# Altium schematic sheet Encoder.SchDoc: Acondicionamiento Encoder
size A4; Author: Anderson, Jorge.; CompanyName: LEICI - FI-UNLP; DocumentNumber: 1; Revision: 1.1; SheetNumber: 3; SheetTotal: 5; PageSetup: Record=PageOptions|CenterHorizontal=True|CenterVertical=True|PrintScale=1.00|XCorrection=1.00|YCorrection=1.00|PrintKind=0|BorderSize=5000000|LeftOffset=0|BottomOffset=0|Orientation=2|PaperLength=1000|PaperWidth=1000|Scale=100|PaperSource=7|PrintQuality=-3|MediaType=1|DitherType=10|PrintScaleMode=1|PaperKind=A4|PaperIndex=9; ProjectName: Placa Adaptadora TMS320F28335
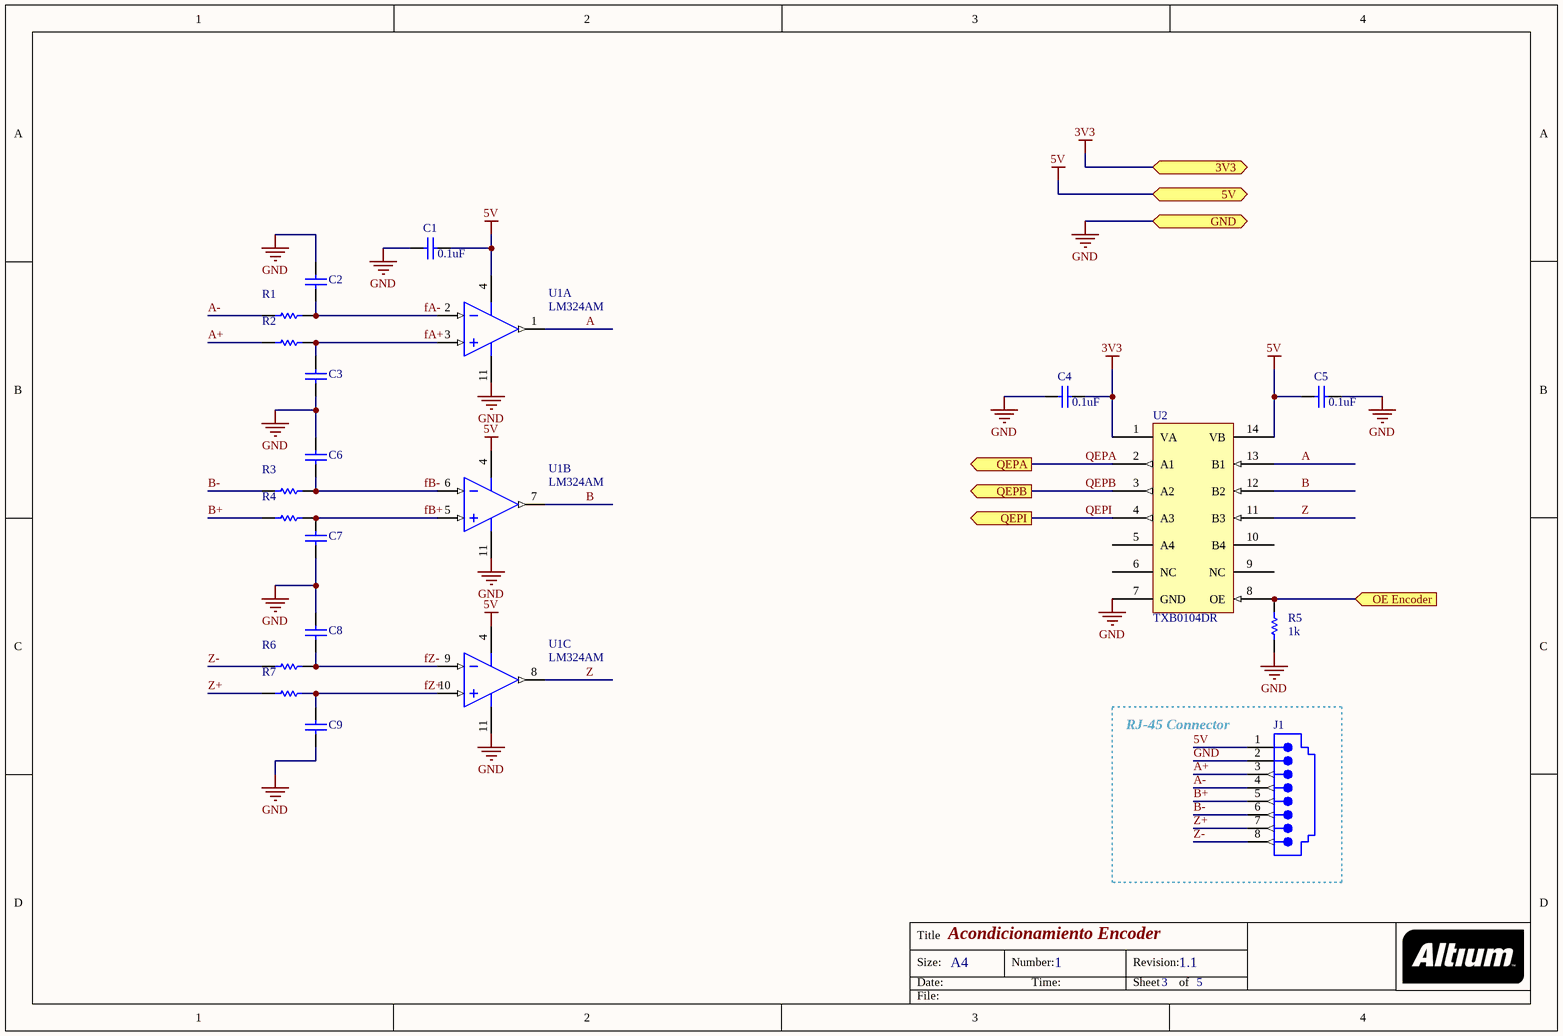
[diagram p0: Encoder.SchDoc]

## Parts
C1  value 0.1uF  [C 1206]  (hidden comment: C0.1u)
C2  C?  [C 1206]  (value not drawn)
C3  C?  [C 1206]  (value not drawn)
C4  value 0.1uF  [C 1206]  (hidden comment: C0.1u)
C5  value 0.1uF  [C 1206]  (hidden comment: C0.1u)
C6  C?  [C 1206]  (value not drawn)
C7  C?  [C 1206]  (value not drawn)
C8  C?  [C 1206]  (value not drawn)
C9  C?  [C 1206]  (value not drawn)
J1  RJ-45 connector  [15-43-6588]  (value not drawn)
R1  R?  [R 1206]  (value not drawn)
R2  R?  [R 1206]  (value not drawn)
R3  R?  [R 1206]  (value not drawn)
R4  R?  [R 1206]  (value not drawn)
R5  value 1k  [R 1206]  (hidden comment: R1k)
R6  R?  [R 1206]  (value not drawn)
R7  R?  [R 1206]  (value not drawn)
U1  LM324AM  [M14A_N]  (parts A,B,C of 4)
U2  TXB0104DR  [SOIC-14]

## Blocks framed on the sheet
RJ-45 Connector: J1

## Ports
3V3, 5V, GND, OE Encoder (in), QEPA (out), QEPB (out), QEPI (out)

## Nets
3V3: C4.2 U2.1(VA) ; port 3V3
5V: C1.2 C5.1 J1.1 U1.4(V+) U2.14(VB) ; port 5V
GND: C1.1 C2.2 C3.1 C4.1 C5.2 C6.2 C7.1 C8.2 C9.1 J1.2 R5.1 U1.11(GND) U2.7(GND) ; port GND
A: U1.1(OUT1) U2.13(B1)
A+: J1.3 R2.2
A-: J1.4 R1.2
B: U1.7(OUT2) U2.12(B2)
B+: J1.5 R4.2
B-: J1.6 R3.2
fA+: C3.2 R2.1 U1.3(IN1+)
fA-: C2.1 R1.1 U1.2(IN1-)
fB+: C7.2 R4.1 U1.5(IN2+)
fB-: C6.1 R3.1 U1.6(IN2-)
fZ+: C9.2 R7.1 U1.10(IN3+)
fZ-: C8.1 R6.1 U1.9(IN3-)
OE Encoder: R5.2 U2.8(OE) ; port OE Encoder
QEPA: U2.2(A1) ; port QEPA
QEPB: U2.3(A2) ; port QEPB
QEPI: U2.4(A3) ; port QEPI
Z: U1.8(OUT3) U2.11(B3)
Z+: J1.7 R7.2
Z-: J1.8 R6.2

Not connected (* = marked no-connect by the designer): U2 5(A4) 6(NC) 9(NC) 10(B4)

## Notes on the sheet
- Title
- Size:
- Date:
- A4
- Number:
- Time:
- Revision:
- Sheet
- of
- File:

## Library data of the parts
C1-C9 = C: Capacitor; .PCBCheck: Used; .Creator: SR; .SCHCheck: Used; Category: Capacitores
J1 = 15-43-6588: RJ-45 connector, 8-pins, ethernet; Ports: 1; Positions/Loaded: Port1 - 8/8; PerformanceCategory: 3; PCB_Mounting: Thru-Hole; ComponentAvailability: Obsolete; DrillSize: Nominal, Rounded to nearest 0.05mm; PCB_Layout: Complies with Manufacturer's Recommendation.; Published: 25-Jun-2002; DatasheetDocument: 18-Dec-2001; PackageDocument: 18-Dec-2001; PackageReference: 15-43-6588; Publisher: Altium Limited; ComponentLink1Description: Manufacturer Link; ComponentLink1URL: http://www.molex.com/; ComponentLink2Description: Datasheet; ComponentLink2URL: http://www.molex.com/cmc_upload/common_files/1212003_catalogmx41314.pdf; ComponentLink3Description: Iges Model; ComponentLink3URL: http://www.molex.com/pdm_docs/igs/15-43-6233_igs.zip
R1-R7 = R: Resistencia; .Creator: SR; .PCBCheck: Used; .SCHCheck: Used; Category: Resistencias
U1 = LM324AM: Low Power Quad Operational Amplifier, 14-pin Narrow SOIC; Manufacturer: National Semiconductor; PackageTopMarking: NSUZXYTTE#*LM324AM; PowerWise: N; CompType: Amplifiers; High-Reliability: Y; DatasheetVersion: Aug-2000; PackageVersion: revJ, Jan-1996; PackageReference: M14A; PackageDescription: Molded Package S.O., .150in Wide, 14 Lead; PartNumber: LM324AM; RoHS: N; PinCount: 14; Code_JEDEC: MS-012AB; Code_IPC: SOIC127P600-14; ComponentLink1Description: Manufacturer URL; ComponentLink1URL: http://www.national.com/; ComponentLink2Description: LM324 Datasheet; ComponentLink2URL: http://www.national.com/ds/LM/LM324.pdf; ComponentLink3Description: LM324 Web Page; ComponentLink3URL: http://www.national.com/pf/LM/LM324.html; ComponentLink4Description: M14A Package Page; ComponentLink4URL: http://www.national.com/packaging/folders/m14a.html
U2 = TXB0104DR: IC VOLT-LEVEL TRANSLATOR 14-SOIC; Manufacturer: Texas Instruments; Logic Function: Translator, Bidirectional; Number of Bits: 4; Input Type: Logic; Data Rate: 100Mbps; Number of Outputs/Channel: 1; Differential - Input:Output: No/No; Propagation Delay (Max): 4ns; Voltage - Supply: 1.2 V ~ 3.6 V, 1.65 V ~ 5.5 V; Supplier 1: Digi-Key; Manufacturer Part Number: TXB0104DR; RoHS: RoHS Compliant; Category: Integrated Circuits (ICs); Stock 1: 15688; Pricing 1: 1=1.69, 10=1.493, 25=1.348, 100=1.1794, 250=1.03428, 500=0.91728, 750=0.80028, 1000=0.7254 (USD); Packaging: Cut Tape (CT); Output Type: Logic; Number of Channels: 4; Operating Temperature: -40°C ~ 85°C; Package / Case: 14-SOIC (0.154", 3.90mm Width); Supplier Device Package: 14-SOIC; Mounting Type: Surface Mount; ComponentLink1URL: http://www.ti.com/lit/ds/symlink/txb0104.pdf; ComponentLink1Description: http://www.ti.com/lit/ds/symlink/txb0104.pdf; Supplier Part Number 1: 296-21928-1-ND